# Altium schematic sheet DIO_logic.SchDoc
size 420 x 297 mm; DocumentNumber: 8; SheetNumber: 8; SheetTotal: 8; EDA_Number: ARTIQ; ModifiedBy: -; Title2: -; DivGrp: ISE; ModifiedDate: -
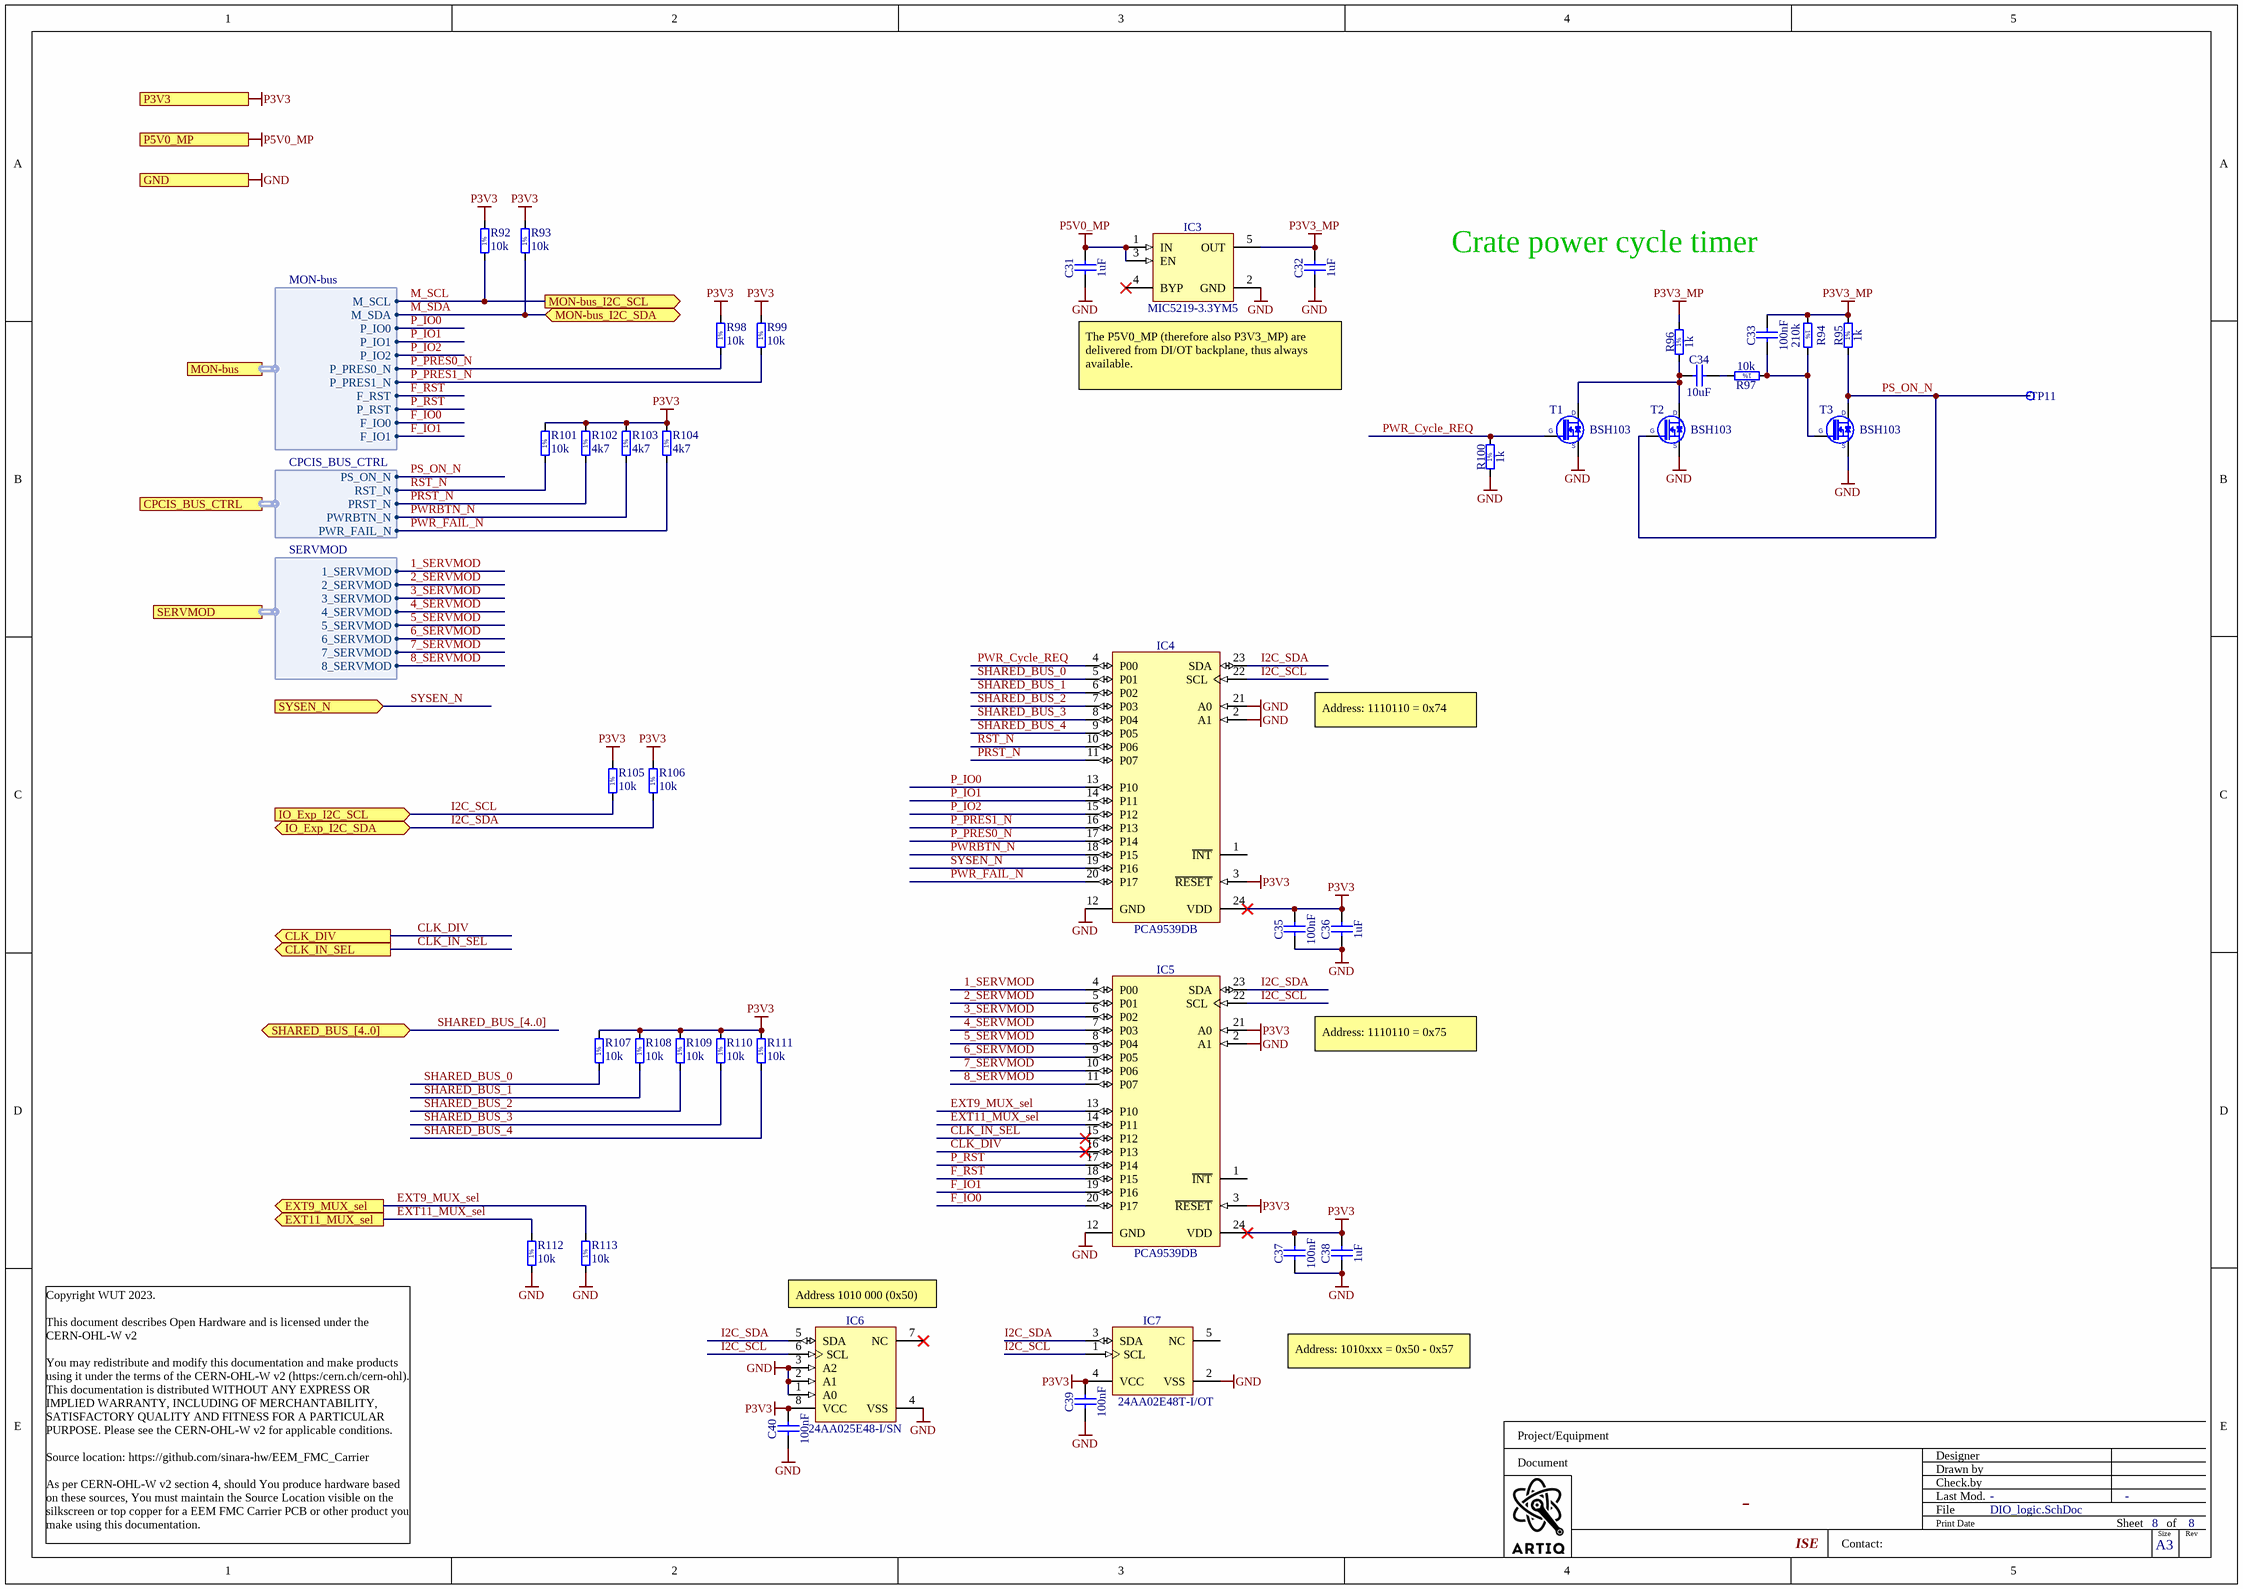
[diagram p0: DIO_logic.SchDoc]

## Parts
C31  1uF  [CAPC1608X87N]
C32  1uF  [CAPC1608X87N]
C33  100nF  [CAPC1005X55N]
C34  10uF  [CAPC1608X80N]
C35  100nF  [CAPC1005X55N]
C36  1uF  [CAPC1608X87N]
C37  100nF  [CAPC1005X55N]
C38  1uF  [CAPC1608X87N]
C39  100nF  [CAPC1005X55N]
C40  100nF  [CAPC1005X55N]
IC3  MIC5219-3.3YM5  [SOT95P280X145-5N]
IC4  PCA9539DB  [SOP65P780X200-24N]
IC5  PCA9539DB  [SOP65P780X200-24N]
IC6  24AA025E48-I/SN  [SOIC127P600X175-8N]
IC7  24AA02E48T-I/OT  [SOT95P280X145-5N]
R92  10k  [RESC1005X40N]
R93  10k  [RESC1005X40N]
R94  210k  [RESC1005X40N]
R95  1k  [RESC1005X40N]
R96  1k  [RESC1005X40N]
R97  10k  [RESC1005X40N]
R98  10k  [RESC1005X40N]
R99  10k  [RESC1005X40N]
R100  1k  [RESC1005X40N]
R101  10k  [RESC1005X40N]
R102  4k7  [RESC1005X40N]
R103  4k7  [RESC1005X40N]
R104  4k7  [RESC1005X40N]
R105  10k  [RESC1005X40N]
R106  10k  [RESC1005X40N]
R107  10k  [RESC1005X40N]
R108  10k  [RESC1005X40N]
R109  10k  [RESC1005X40N]
R110  10k  [RESC1005X40N]
R111  10k  [RESC1005X40N]
R112  10k  [RESC1005X40N]
R113  10k  [RESC1005X40N]
T1  BSH103  [SOT95P230X110-3N]
T2  BSH103  [SOT95P230X110-3N]
T3  BSH103  [SOT95P230X110-3N]
TP11  P3V3  [TPS127]  (value not drawn)  (no BOM)

## Ports
CLK_DIV (out), CLK_IN_SEL (out), CPCIS_BUS_CTRL (harness CPCIS_BUS_CTRL), EXT9_MUX_sel (out), EXT11_MUX_sel (out), GND, IO_Exp_I2C_SCL (in), IO_Exp_I2C_SDA (bidir), MON-bus (harness MON-bus), MON-bus_I2C_SCL (out), MON-bus_I2C_SDA (bidir), P3V3 (in), P5V0_MP (in), SERVMOD (harness SERVMOD), SHARED_BUS_[4..0] (bidir), SYSEN_N (in)

## Harnesses
CPCIS_BUS_CTRL: PS_ON_N, RST_N, PRST_N, PWRBTN_N, PWR_FAIL_N
MON-bus: M_SCL, M_SDA, P_IO0, P_IO1, P_IO2, P_PRES0_N, P_PRES1_N, F_RST, P_RST, F_IO0, F_IO1
SERVMOD: 5_SERVMOD, 6_SERVMOD, 2_SERVMOD, 7_SERVMOD, 3_SERVMOD, 4_SERVMOD, 1_SERVMOD, 8_SERVMOD

## Nets
GND: C31.1 C32.1 C35.1 C36.1 C37.1 C38.1 C39.1 C40.1 IC3.2(GND) IC4.2(A1) IC4.12(GND) IC4.21(A0) IC5.2(A1) IC5.12(GND) IC6.1(A0) IC6.2(A1) IC6.3(A2) IC6.4(VSS) IC7.2(VSS) R100.1 R112.1 R113.1 T1.2(S) T2.2(S) T3.2(S) ; port GND
P3V3: C35.2 C36.2 C37.2 C38.2 C39.2 C40.2 IC4.3(~{RESET}) IC4.24(VDD) IC5.3(~{RESET}) IC5.21(A0) IC5.24(VDD) IC6.8(VCC) IC7.4(VCC) R92.2 R93.2 R98.2 R99.2 R101.2 R102.2 R103.2 R104.2 R105.2 R106.2 R107.2 R108.2 R109.2 R110.2 R111.2 ; port P3V3
P3V3_MP: C32.2 C33.2 IC3.5(OUT) R94.1 R95.2 R96.2
P5V0_MP: C31.2 IC3.1(IN) IC3.3(EN) ; port P5V0_MP
1_SERVMOD: IC5.4(P00) ; port SERVMOD.1_SERVMOD
2_SERVMOD: IC5.5(P01) ; port SERVMOD.2_SERVMOD
3_SERVMOD: IC5.6(P02) ; port SERVMOD.3_SERVMOD
4_SERVMOD: IC5.7(P03) ; port SERVMOD.4_SERVMOD
5_SERVMOD: IC5.8(P04) ; port SERVMOD.5_SERVMOD
6_SERVMOD: IC5.9(P05) ; port SERVMOD.6_SERVMOD
7_SERVMOD: IC5.10(P06) ; port SERVMOD.7_SERVMOD
8_SERVMOD: IC5.11(P07) ; port SERVMOD.8_SERVMOD
CLK_DIV: IC5.16(P13) ; port CLK_DIV
CLK_IN_SEL: IC5.15(P12) ; port CLK_IN_SEL
EXT9_MUX_sel: IC5.13(P10) R113.2 ; port EXT9_MUX_sel
EXT11_MUX_sel: IC5.14(P11) R112.2 ; port EXT11_MUX_sel
F_IO0: IC5.20(P17) ; port MON-bus.F_IO0
F_IO1: IC5.19(P16) ; port MON-bus.F_IO1
F_RST: IC5.18(P15) ; port MON-bus.F_RST
I2C_SCL: IC4.22(SCL) IC5.22(SCL) IC6.6(SCL) IC7.1(SCL) R105.1 ; port IO_Exp_I2C_SCL
I2C_SDA: IC4.23(SDA) IC5.23(SDA) IC6.5(SDA) IC7.3(SDA) R106.1 ; port IO_Exp_I2C_SDA
M_SCL: R92.1 ; port MON-bus_I2C_SCL, port MON-bus.M_SCL
M_SDA: R93.1 ; port MON-bus_I2C_SDA, port MON-bus.M_SDA
P_IO0: IC4.13(P10) ; port MON-bus.P_IO0
P_IO1: IC4.14(P11) ; port MON-bus.P_IO1
P_IO2: IC4.15(P12) ; port MON-bus.P_IO2
P_PRES0_N: IC4.17(P14) R98.1 ; port MON-bus.P_PRES0_N
P_PRES1_N: IC4.16(P13) R99.1 ; port MON-bus.P_PRES1_N
P_RST: IC5.17(P14) ; port MON-bus.P_RST
PRST_N: IC4.11(P07) R102.1 ; port CPCIS_BUS_CTRL.PRST_N
PS_ON_N: R95.1 T2.1(G) T3.3(D) TP11.1 ; port CPCIS_BUS_CTRL.PS_ON_N
PWR_Cycle_REQ: IC4.4(P00) R100.2 T1.1(G)
PWR_FAIL_N: IC4.20(P17) R104.1 ; port CPCIS_BUS_CTRL.PWR_FAIL_N
PWRBTN_N: IC4.18(P15) R103.1 ; port CPCIS_BUS_CTRL.PWRBTN_N
RST_N: IC4.10(P06) R101.1 ; port CPCIS_BUS_CTRL.RST_N
SHARED_BUS_0: IC4.5(P01) R107.1
SHARED_BUS_1: IC4.6(P02) R108.1
SHARED_BUS_2: IC4.7(P03) R109.1
SHARED_BUS_3: IC4.8(P04) R110.1
SHARED_BUS_4: IC4.9(P05) R111.1
SYSEN_N: IC4.19(P16) ; port SYSEN_N
NetC33_1: C33.1 R94.2 R97.1 T3.1(G)
NetC34_1: C34.1 R96.1 T1.3(D) T2.3(D)
NetC34_2: C34.2 R97.2

Not connected (* = marked no-connect by the designer): IC3 4(BYP)*; IC4 1(~{INT}); IC5 1(~{INT}); IC6 7(NC)*; IC7 5(NC)

## Buses and harness runs
bus SHARED_BUS_[4..0] = port SHARED_BUS_[4..0]

## Notes on the sheet
- Crate power cycle timer
- The P5V0_MP (therefore also P3V3_MP) are delivered from DI/OT backplane, thus always available.
- Address: 1110110 = 0x74
- Address: 1110110 = 0x75
- (near IC6) Address 1010 000 (0x50)
- Address: 1010xxx = 0x50 - 0x57
- Project/Equipment
- Document
- Designer
- Drawn by
- Check.by
- Copyright WUT 2023.
  This document describes Open Hardware and is licensed under the CERN-OHL-W v2
  You may redistribute and modify this documentation and make products using it under the terms of the CERN-OHL-W v2 (https:/cern.ch/cern-ohl). This documentation is distributed WITHOUT ANY EXPRESS OR IMPLIED WARRANTY, INCLUDING OF MERCHANTABILITY, SATISFACTORY QUALITY AND FITNESS FOR A PARTICULAR PURPOSE. Please see the CERN-OHL-W v2 for applicable conditions.
  Source location: https://github.com/sinara-hw/EEM_FMC_Carrier
  As per CERN-OHL-W v2 section 4, should You produce hardware based on these sources, You must maintain the Source Location visible on the silkscreen or top copper for a EEM FMC Carrier PCB or other product you make using this documentation.
- Contact:
- File
- Last Mod.
- Print Date
- Sheet
- Size
- A3
- of
- Rev
- (in symbol R0402_1K_1%_0.0625W_100PPM) 1%
- (in symbol R0402_4K7_1%_0.0625W_100PPM) 1%
- (in symbol R0402_10K_1%_0.0625W_100PPM) 1%
- (in symbol R0402_210R_1%_0.0625W_100PPM) 1%

## Library data of the parts
C31 C32 C36 C38 = CC0603_1UF_25V_10%_X7R: Non-polarised capacitor; Part Description: SMD Multilayer Chip Ceramic Capacitor; Manufacturer: GENERIC; Manufacturer1 Part Number: GRM188R71E105KA12D; Voltage: 25V; TC: X7R; Tolerance: ±10%; Part Number: CC0603_1UF_25V_10%_X7R; Component Kind: Standard; Component Type: Standard; Pin Count: 2; Value: 1uF; Status: None; Manufacturer Part Number: CC0603_1UF_25V_10%_X7R; Case: 0603; Mounted: Yes; Socket: No; SMD: Yes; Sense: No; Manufacturer1 Example: MURATA; Manufacturer1 ComponentHeight: 0.9mm; HelpURL: \\cern.ch\dfs\Applications\Altium\Datasheets\CC0603_X7R_MURATA.pdf; Author: CERN DEM JLC; CreateDate: 18.01.2011; LatestRevisionDate: 18.01.2011
C33 C35 C37 C39 C40 = CC0402_100NF_16V_10%_X7R: Non-polarised capacitor; Part Description: SMD Multilayer Chip Ceramic Capacitor; Manufacturer: GENERIC; Manufacturer1 Part Number: GRM155R71C104KA88D; Voltage: 16V; TC: X7R; Tolerance: ±10%; Part Number: CC0402_100NF_16V_10%_X7R; Component Kind: Standard; Component Type: Standard; Pin Count: 2; Value: 100nF; Status: Not Recommended; Manufacturer Part Number: CC0402_100NF_16V_10%_X7R; Case: 0402; Mounted: Yes; Socket: No; SMD: Yes; Sense: No; HelpURL: \\cern.ch\dfs\Applications\Altium\Datasheets\CC0402_X7R_MURATA_GRM.pdf; Author: CERN DEM JLC; CreateDate: 05.12.2013; LatestRevisionDate: 03.12.2007; Manufacturer1 Example: MURATA; Manufacturer1 ComponentHeight: 0.55mm
C34 = CC0603_10UF_10V_10%_X5R: Non-polarised capacitor; Part Description: SMD Multilayer Chip Ceramic Capacitor; Manufacturer: GENERIC; Manufacturer1 Part Number: GRM188R61A106KE69D; Voltage: 10V; TC: X5R; Tolerance: ±10%; Part Number: CC0603_10UF_10V_10%_X5R; Component Kind: Standard; Component Type: Standard; Pin Count: 2; Value: 10uF; Status: None; Manufacturer Part Number: CC0603_10UF_10V_10%_X5R; Case: 0603; Mounted: Yes; Socket: No; SMD: Yes; Sense: No; Manufacturer1 Example: MURATA; Manufacturer1 ComponentHeight: 0.8mm; HelpURL: \\cern.ch\dfs\Applications\Altium\Datasheets\CC0603_MURATA_GRM188R61A106KE69D.pdf; Author: CERN DEM JLC; CreateDate: 31.01.2017; LatestRevisionDate: 31.01.2017
IC3 = MIC5219-3.3YM5: 500mA Peak Output LDO Regulator; Part Description: 3.3V 500mA Peak Output Low Drop-Out  (LDO) Regulator; Manufacturer: MICROCHIP TECHNOLOGY; PressFit: No; Bonding: No; Part Number: MIC5219-3.3YM5; Component Kind: Standard; Component Type: Standard; Device: MIC5219-3.3YM5; PackageDescription: SOT, 0.95mm pitch; 5 pin, 1.60mm W X 2.90mm L X 1.45mm H body, IPC Medium Density; Manufacturer Part Number: MIC5219-3.3YM5; Pin Count: 5; Case: SOT23-5; Mounted: Yes; Socket: No; SMD: Yes; Sense: No; ComponentHeight: 1.45mm; HelpURL: \\cern.ch\dfs\Applications\Altium\Datasheets\MIC5219-3.3YM5.pdf; Author: CERN DEM WB; CreateDate: 2019-04-16; LatestRevisionDate: 2019-04-16
IC4 IC5 = PCA9539DB: Remote 16-Bit I2C and SMBus Low-Power I/O Expander With Interrupt Output, Reset, and Configuration Registers; Manufacturer: TEXAS INSTRUMENTS; PressFit: No; Bonding: No; Part Number: PCA9539DB; Component Kind: Standard; Component Type: Standard; Device: PCA9539DB; PackageDescription: SOP, 0.65mm Pitch; 24 pin, 5.30mm W X 8.20mm L X 2.00mm H body, IPC Medium Density; Part Description: Remote 16-Bit I2C and SMBus Low-Power I/O Expander with Interrupt Output, Reset, and Configuration Registers; Manufacturer Part Number: PCA9539DB; Pin Count: 24; Case: TSSOP24; Mounted: Yes; Socket: No; SMD: Yes; Sense: No; ComponentHeight: 2mm; Author: CERN DEM HF; HelpURL: \\cern.ch\dfs\Applications\Altium\Datasheets\PCA9539DB.pdf; CreateDate: 09.06.2022; LatestRevisionDate: 09.06.2022
IC6 = 24AA025E48-I/SN: 1.7V-5.5V, 2K I2C™ Serial EEPROMs with EUI-48™ Node Identity; Manufacturer: MICROCHIP TECHNOLOGY; PressFit: No; Bonding: No; Part Number: 24AA025E48-I/SN; Component Kind: Standard; Component Type: Standard; Device: 24AA025E48-I/SN; PackageDescription: SOIC 8, Pitch 1.27mm - Body 4x5mm, IPC Medium Density; Part Description: 1.7V-5.5V, 2K I2C™ Serial EEPROMs with EUI-48™ Node Identity; Manufacturer Part Number: 24AA025E48-I/SN; Pin Count: 8; Case: SOIC8; Mounted: Yes; Socket: No; SMD: Yes; Sense: No; ComponentHeight: 1.75mm; HelpURL: \\cern.ch\dfs\Applications\Altium\Datasheets\24AA025E48-I-SN.pdf; Author: CERN DEM MR; CreateDate: 19.07.2016; LatestRevisionDate: 19.07.2016
IC7 = 24AA02E48T-I/OT: 1.7V-5.5V, 2K I2C Serial EEPROM With EUI-48 Node Identity; Manufacturer: MICROCHIP TECHNOLOGY; PressFit: No; Bonding: No; Part Number: 24AA02E48T-I/OT; Component Kind: Standard; Component Type: Standard; Device: 24AA02E48T-I/OT; PackageDescription: SOT, 0.95mm pitch; 5 pin, 1.60mm W X 2.90mm L X 1.45mm H body, IPC Medium Density; Part Description: 1.7V-5.5V, 2K I2C Serial EEPROM With EUI-48 Node Identity; Manufacturer Part Number: 24AA02E48T-I/OT; Pin Count: 5; Case: SOT23-5; Mounted: Yes; Socket: No; SMD: Yes; Sense: No; ComponentHeight: 1.45mm; HelpURL: \\cern.ch\dfs\Applications\Altium\Datasheets\24AA02E48T-I-OT.pdf; Author: CERN DEM MR; CreateDate: 31.03.2016; LatestRevisionDate: 31.03.2016
R92 R93 R98 R99 R101 R105-R113 = R0402_10K_1%_0.0625W_100PPM: Resistor - 1%; Part Description: General Purpose Thick Film Chip Resistor; Manufacturer: GENERIC; Manufacturer1 Part Number: 232270671003L; TC: ±100ppm/°C; Part Number: R0402_10K_1%_0.0625W_100PPM; Component Kind: Standard; Component Type: Standard; Pin Count: 2; Value: 10k; Status: Not recommended; Power: 0.0625W; Tolerance: ±1%; Manufacturer Part Number: R0402_10K_1%_0.0625W_100PPM; Case: 0402; Mounted: Yes; Sense: No; Socket: No; SMD: Yes; Manufacturer1 Example: YAGEO PHYCOMP; Manufacturer1 ComponentHeight: 0.4mm; HelpURL: \\cern.ch\dfs\Applications\Altium\Datasheets\R0402_Phycomp_RC0402.pdf; Author: CERN DEM JLC; CreateDate: 03.12.2007; LatestRevisionDate: 17.10.2012
R94 = R0402_210R_1%_0.0625W_100PPM: Resistor - 1%; Part Number: R0402_210k_1%_0.0625W_100PPM; Part Description: General Purpose Thick Film Chip Resistor; Manufacturer: GENERIC; Manufacturer1 Part Number: CRCW0402240RFKED; TC: ±100ppm/°C; PressFit: No; Component Kind: Standard; Component Type: Standard; Pin Count: 2; Value: 210k; Status: None; Power: 0.0625W; Tolerance: ±1%; Manufacturer Part Number: R0402_210K_1%_0.0625W_100PPM; Case: 0402; Mounted: Yes; Sense: No; Socket: No; SMD: Yes; Manufacturer1 Example: VISHAY; Manufacturer1 ComponentHeight: 0.4mm; HelpURL: \\cern.ch\dfs\Applications\Altium\Datasheets\R0402_VISHAY_CRCW e3.pdf; Author: CERN DEM MR; CreateDate: 22-Nov-16; LatestRevisionDate: 22-Nov-16
R95 R96 R100 = R0402_1K_1%_0.0625W_100PPM: Resistor - 1%; Part Description: General Purpose Thick Film Chip Resistor; Manufacturer: GENERIC; Manufacturer1 Part Number: 232270671002L; TC: ±100ppm/°C; PressFit: No; Part Number: R0402_1K_1%_0.0625W_100PPM; Component Kind: Standard; Component Type: Standard; Pin Count: 2; Value: 1k; Status: Not Recommended; Power: 0.0625W; Tolerance: ±1%; Manufacturer Part Number: R0402_1K_1%_0.0625W_100PPM; Case: 0402; Mounted: Yes; Sense: No; Socket: No; SMD: Yes; Manufacturer1 Example: YAGEO PHYCOMP; Manufacturer1 ComponentHeight: 0.4mm; HelpURL: \\cern.ch\dfs\Applications\Altium\Datasheets\R0402_Phycomp_RC0402.pdf; Author: CERN DEM JLC; CreateDate: 03/12/2007; LatestRevisionDate: 17/10/2012
R97 = R0402_10K_1%_0.0625W_100PPM: Resistor - 1%; Part Description: General Purpose Thick Film Chip Resistor; Manufacturer: GENERIC; Manufacturer1 Part Number: 232270671003L; TC: ±100ppm/°C; PressFit: No; Part Number: R0402_10K_1%_0.0625W_100PPM; Component Kind: Standard; Component Type: Standard; Pin Count: 2; Value: 10k; Status: Not Recommended; Power: 0.0625W; Tolerance: ±1%; Manufacturer Part Number: R0402_10K_1%_0.0625W_100PPM; Case: 0402; Mounted: Yes; Sense: No; Socket: No; SMD: Yes; Manufacturer1 Example: YAGEO PHYCOMP; Manufacturer1 ComponentHeight: 0.4mm; HelpURL: \\cern.ch\dfs\Applications\Altium\Datasheets\R0402_Phycomp_RC0402.pdf; Author: CERN DEM JLC; CreateDate: 03-Dec-07; LatestRevisionDate: 17-Oct-12
R102-R104 = R0402_4K7_1%_0.0625W_100PPM: Resistor - 1%; Part Description: General Purpose Thick Film Chip Resistor; Manufacturer: GENERIC; Manufacturer1 Part Number: 232270674702L; TC: ±100ppm/°C; PressFit: No; Part Number: R0402_4K7_1%_0.0625W_100PPM; Component Kind: Standard; Component Type: Standard; Pin Count: 2; Value: 4k7; Status: Not Recommended; Power: 0.0625W; Tolerance: ±1%; Manufacturer Part Number: R0402_4K7_1%_0.0625W_100PPM; Case: 0402; Mounted: Yes; Sense: No; Socket: No; SMD: Yes; Manufacturer1 Example: YAGEO PHYCOMP; Manufacturer1 ComponentHeight: 0.4mm; HelpURL: \\cern.ch\dfs\Applications\Altium\Datasheets\R0402_Phycomp_RC0402.pdf; Author: CERN DEM JLC; CreateDate: 03-Dec-07; LatestRevisionDate: 17-Oct-12
T1-T3 = BSH103: N-CHANNEL MOSFET WITH DIODE; Part Description: 30V 850mA N-Channel Enhancement Mode Field-Effect Transistor; Manufacturer: NEXPERIA; PressFit: No; Bonding: No; Part Number: BSH103; Component Kind: Standard; Component Type: Standard; Device: BSH103; PackageDescription: SOT23, 3 pin, Pitch 0.95mm - 1.3mm W X 2.9mm L X 1.1mm H, IPC Medium Density; Manufacturer Part Number: BSH103; Pin Count: 3; Case: SOT23-3; Mounted: Yes; Socket: No; SMD: Yes; Sense: No; ComponentHeight: 1.1mm; HelpURL: \\cern.ch\dfs\Applications\Altium\Datasheets\BSH103.pdf; Author: CERN DEM JLC; CreateDate: 16.03.2010; LatestRevisionDate: 20.06.2017; ClassName: Artix
TP11 = SMD_PAD_1.27X1.27MM: Test Point; Part Description: 1.27mm x 1.27mm PCB Copper Area (SMD Test Point); Mounted: No; Part Number: SMD_PAD_1.27X1.27MM; Component Type: Standard (No BOM); Pin Count: 1; Family: Test Point; Socket: No; SMD: Yes; Sense: No; Status: None; ComponentHeight: 0mm; HelpURL: Undefined; Author: CERN DEM JLC; CreateDate: 12.01.2008; LatestRevisionDate: 12.01.2008; PackageDescription: 1.27mm x 1.27mm PCB Copper Area (SMD Test Point)